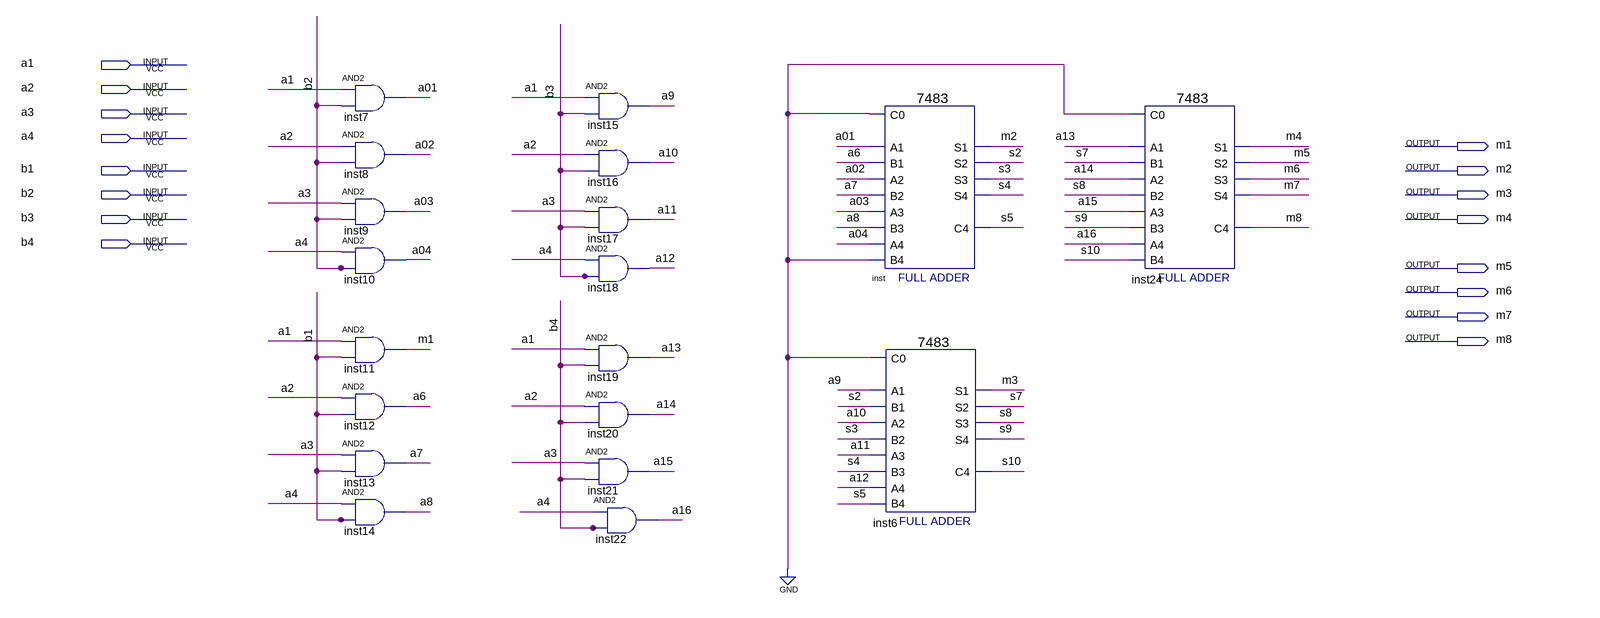
[diagram p0: schematic sheet]
// Quartus schematic 4x4_Multiplication.bdf as structural Verilog: 19 symbols, 16 pins
module \4x4_Multiplication  (
  input  a1,
  input  a2,
  input  a3,
  input  a4,
  input  b1,
  input  b2,
  input  b3,
  input  b4,
  output m1,
  output m2,
  output m3,
  output m4,
  output m5,
  output m6,
  output m7,
  output m8
);

  wire a01, a02, a03, a04, a6, a7, a8, a9, a10, a11, a12, a13, a14, a15, a16, s2, s3, s4, s5, s7, s8, s9, s10;

  and inst7 (a01, a1, b2);
  and inst8 (a02, a2, b2);
  and inst9 (a03, a3, b2);
  and inst10 (a04, a4, b2);
  and inst11 (m1, a1, b1);
  and inst12 (a6, a2, b1);
  and inst13 (a7, a3, b1);
  and inst14 (a8, a4, b1);
  and inst15 (a9, a1, b3);
  and inst16 (a10, a2, b3);
  and inst17 (a11, a3, b3);
  and inst18 (a12, a4, b3);
  and inst19 (a13, a1, b4);
  and inst20 (a14, a2, b4);
  and inst21 (a15, a3, b4);
  and inst22 (a16, a4, b4);
  \7483  inst (
    .B4(1'b0), .C0(1'b0), .A1(a01), .A2(a02), .B1(a6), .B2(a7), .A3(a03), .B3(a8), .A4(a04), .S3(s3),
    .S4(s4), .S2(s2), .C4(s5), .S1(m2));
  \7483  inst6 (
    .B4(s5), .A1(a9), .A2(a10), .B1(s2), .B2(s3), .A3(a11), .B3(s4), .A4(a12), .S3(s8), .S4(s9), .S2(s7),
    .C4(s10), .S1(m3));  // open: C0
  \7483  inst24 (
    .B4(s10), .C0(1'b0), .A1(a13), .A2(a14), .B1(s7), .B2(s8), .A3(a15), .B3(s9), .A4(a16), .S3(m6), .S4(m7),
    .S2(m5), .C4(m8), .S1(m4));
endmodule
